# Altium schematic sheet Led 7 dig display.SchDoc
size A4
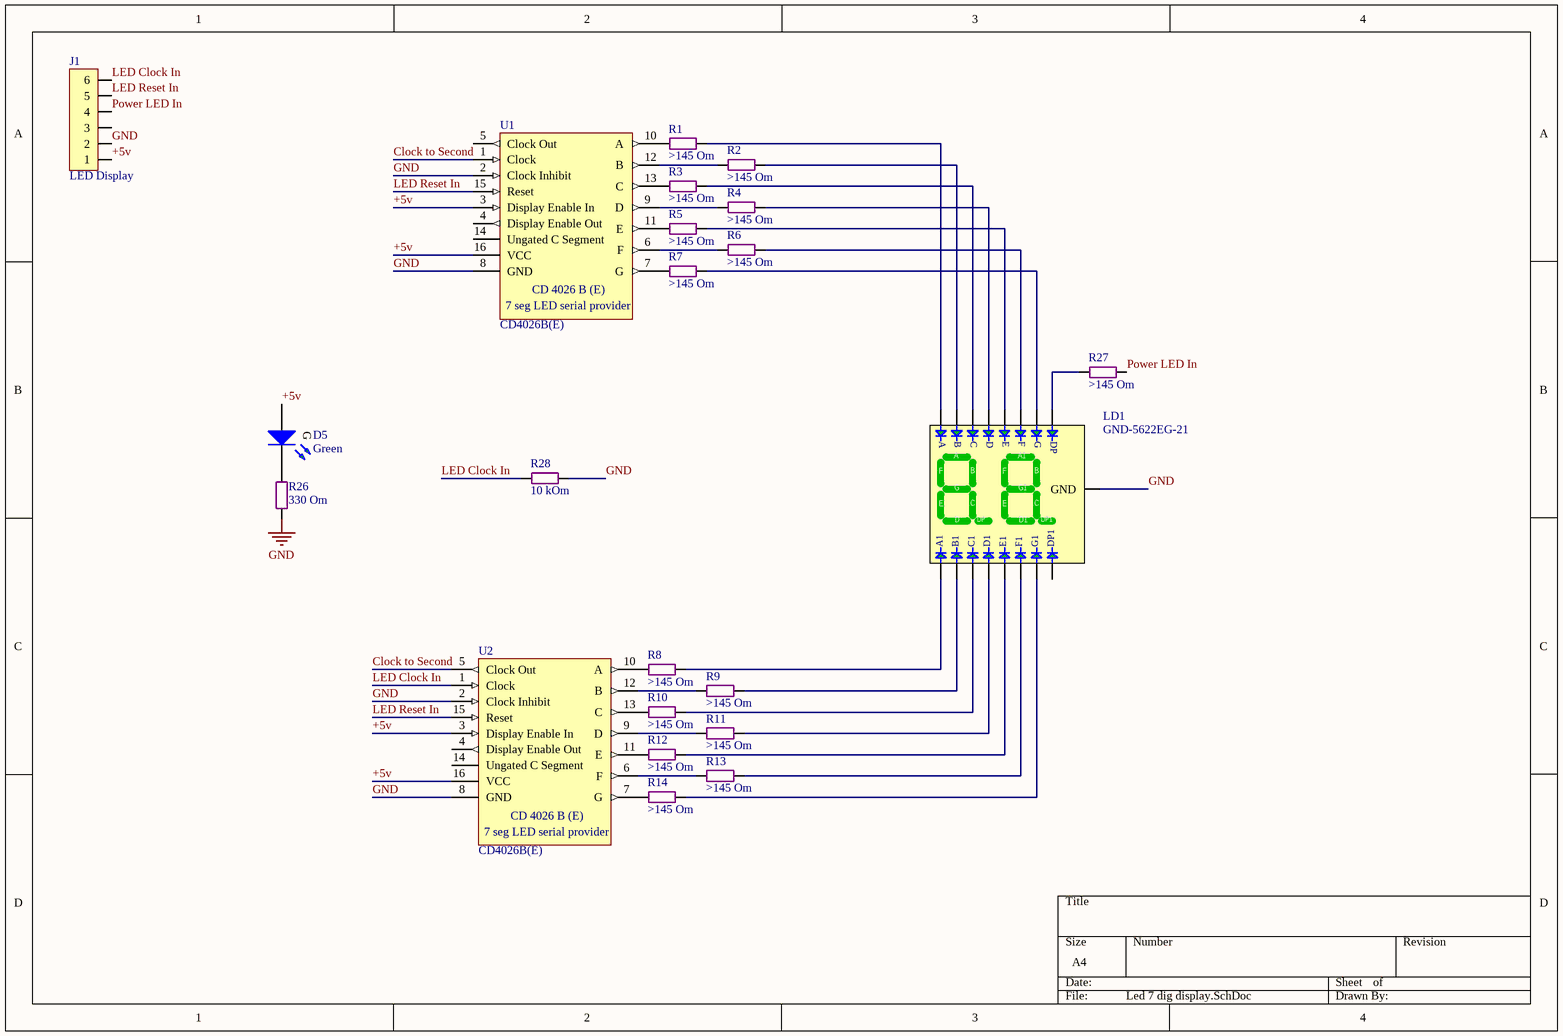
[diagram p0: Led 7 dig display.SchDoc]

## Parts
D5  Green  [LED SMD 0805 Green]
J1  LED Display  [Molex Micro-Fit 3.0 - 6 pin D R]
LD1  GND-5622EG-21  [GND-5622EG-21]
R1  >145 Om  [SMD 1206 (3216)]
R2  >145 Om  [SMD 1206 (3216)]
R3  >145 Om  [SMD 1206 (3216)]
R4  >145 Om  [SMD 1206 (3216)]
R5  >145 Om  [SMD 1206 (3216)]
R6  >145 Om  [Res p7.62 (4p) 0.25w]
R7  >145 Om  [Res p7.62 (4p) 0.25w]
R8  >145 Om  [SMD 1206 (3216)]
R9  >145 Om  [Res p7.62 (4p) 0.25w]
R10  >145 Om  [SMD 1206 (3216)]
R11  >145 Om  [SMD 1206 (3216)]
R12  >145 Om  [SMD 1206 (3216)]
R13  >145 Om  [SMD 1206 (3216)]
R14  >145 Om  [Res p7.62 (4p) 0.25w]
R26  330 Om  [SMD 1206 (3216)]
R27  >145 Om  [SMD 1206 (3216)]
R28  10 kOm  [SMD 0805 (2012)]
U1  CD4026B(E)  [DIP-16]
U2  CD4026B(E)  [DIP-16]

## Nets
GND: J1.2 LD1.GND R26.2 R28.2 U1.2(Clock_Inhibit) U1.8(GND) U2.2(Clock_Inhibit) U2.8(GND)
+5v: D5.A J1.1 U1.3(Display_Enable_In) U1.16(VCC) U2.3(Display_Enable_In) U2.16(VCC)
Clock to Second: U1.1(Clock) U2.5(Clock_Out)
LED Clock In: J1.6 R28.1 U2.1(Clock)
LED Reset In: J1.5 U1.15(Reset) U2.15(Reset)
Power LED In: J1.4 R27.2
NetD5_K: D5.K R26.1
NetLD1_A: LD1.A R1.2
NetLD1_A1: LD1.A1 R8.2
NetLD1_B: LD1.B R2.2
NetLD1_B1: LD1.B1 R9.2
NetLD1_C: LD1.C R3.2
NetLD1_C1: LD1.C1 R10.2
NetLD1_D: LD1.D R4.2
NetLD1_D1: LD1.D1 R11.2
NetLD1_DP: LD1.DP R27.1
NetLD1_E: LD1.E R5.2
NetLD1_E1: LD1.E1 R12.2
NetLD1_F: LD1.F R6.2
NetLD1_F1: LD1.F1 R13.2
NetLD1_G: LD1.G R7.2
NetLD1_G1: LD1.G1 R14.2
NetR1_1: R1.1 U1.10(A)
NetR2_1: R2.1 U1.12(B)
NetR3_1: R3.1 U1.13(C)
NetR4_1: R4.1 U1.9(D)
NetR5_1: R5.1 U1.11(E)
NetR6_1: R6.1 U1.6(F)
NetR7_1: R7.1 U1.7(G)
NetR8_1: R8.1 U2.10(A)
NetR9_1: R9.1 U2.12(B)
NetR10_1: R10.1 U2.13(C)
NetR11_1: R11.1 U2.9(D)
NetR12_1: R12.1 U2.11(E)
NetR13_1: R13.1 U2.6(F)
NetR14_1: R14.1 U2.7(G)

Not connected (* = marked no-connect by the designer): J1 3; LD1 DP1; U1 4(Display_Enable_Out) 5(Clock_Out) 14(Ungated_C_Segment); U2 4(Display_Enable_Out) 14(Ungated_C_Segment)

## Notes on the sheet
- (in symbol CD4026BE) CD 4026 B (E); 7 seg LED serial provider
- (in symbol Led SMD 0805 Green) G

## Library data of the parts
D5 = Led SMD 0805 Green: ?2v ?20mA; Forward Voltage TYP: ?2; Resistor for 5v VCC: 330 Om; Forward Voltage Min: ?; Wave len min/typ: ?; Liminous Min (mcd): ?; Liminous Typ (mcd): ?; Forward Amp (mA): ?; Color: Green
J1 = Micro-Fit 6R (2x3): Horisontal, Dbl line, Male - 3mm
LD1 = 7 Seg GND-5622EG-21: Green, Common Catode 2 Digits; V Forw: 2.1v; I (amp): 10-20mA; Type: Commopn Catode (GND); Wave: 565nm; Lum: 8-11mCd; Digit Heigh: 14.2mm; Name: GND-5622EG-21; Color: Green; Size: 19x25х8,0mm; Price: 30RUR in 2014year
R1-R14 R26 R28 = Res All Types
R27 = Res SMD 1206
U1 U2 = CD4026BE: jk Trigger; PackageDescription: DIP; 16 Leads; Row Spacing 7.62 mm; Pitch 2.54 mm; ComponentLink1URL: http://www.ti.com/; ComponentLink2Description: Datasheet; ComponentLink2URL: http://www.ti.com/lit/ds/symlink/cd4033b.pdf